# EAGLE design hotswap (EAGLE 6.1)
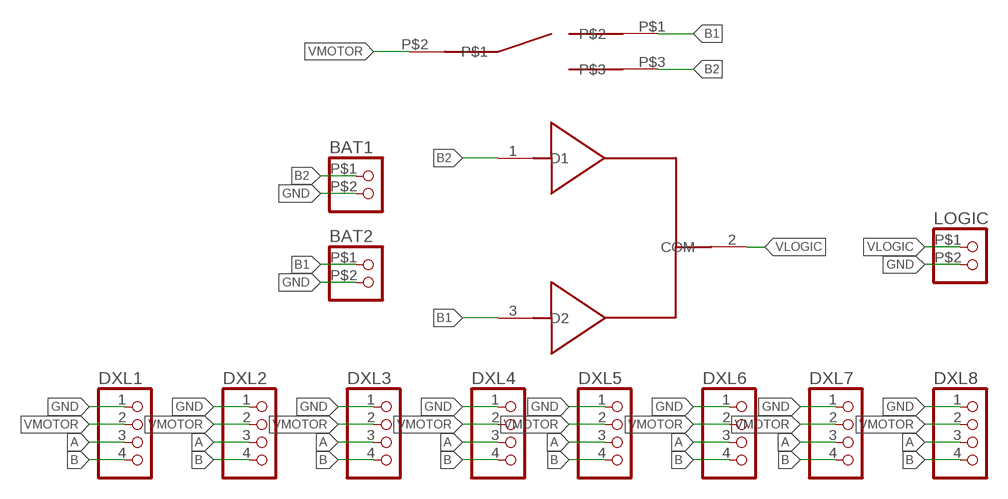
[diagram p0: schematic, sheet 1]

## Parts
BAT1  CONNEC_1X02BIG  [CONNEC_1X02_BIG]
BAT2  CONNEC_1X02BIG  [CONNEC_1X02_BIG]
DXL1  CONNEC_1X04  [CONNEC_1X04]
DXL2  CONNEC_1X04  [CONNEC_1X04]
DXL3  CONNEC_1X04  [CONNEC_1X04]
DXL4  CONNEC_1X04  [CONNEC_1X04]
DXL5  CONNEC_1X04  [CONNEC_1X04]
DXL6  CONNEC_1X04  [CONNEC_1X04]
DXL7  CONNEC_1X04  [CONNEC_1X04]
DXL8  CONNEC_1X04  [CONNEC_1X04]
LOGIC  CONNEC_1X02BIG  [CONNEC_1X02_BIG]
U$1  MBR1545CTG  [TO-220-ALT]
U$2  BIG_SPDT  [BIG_SPDT]

## Nets
A: DXL1.3 DXL2.3 DXL3.3 DXL4.3 DXL5.3 DXL6.3 DXL7.3 DXL8.3
B: DXL1.4 DXL2.4 DXL3.4 DXL4.4 DXL5.4 DXL6.4 DXL7.4 DXL8.4
B1 [alime]: BAT2.P$1 U$1.3(D2) U$2.P$1
B2 [alime]: BAT1.P$1 U$1.1(D1) U$2.P$3
GND: BAT1.P$2 BAT2.P$2 DXL1.1 DXL2.1 DXL3.1 DXL4.1 DXL5.1 DXL6.1 DXL7.1 DXL8.1 LOGIC.P$2
VLOGIC [alime]: LOGIC.P$1 U$1.2(COM)
VMOTOR: DXL1.2 DXL2.2 DXL3.2 DXL4.2 DXL5.2 DXL6.2 DXL7.2 DXL8.2 U$2.P$2

## Library data of the parts
BAT1 BAT2 LOGIC = rhoban:CONNEC_1X02
DXL1-DXL8 = rhoban:CONNEC_1X04; FARNELL: 9979620 OR 1104204
U$1 = rhoban:MBR1545CTG; FARNELL: 1431049
U$2 = rhoban:BIG_SPDT; FARNELL: 150551

## Net classes
1 alime: width 0.889 mm, drill 0.762 mm, clearance 0.508 mm

## Board
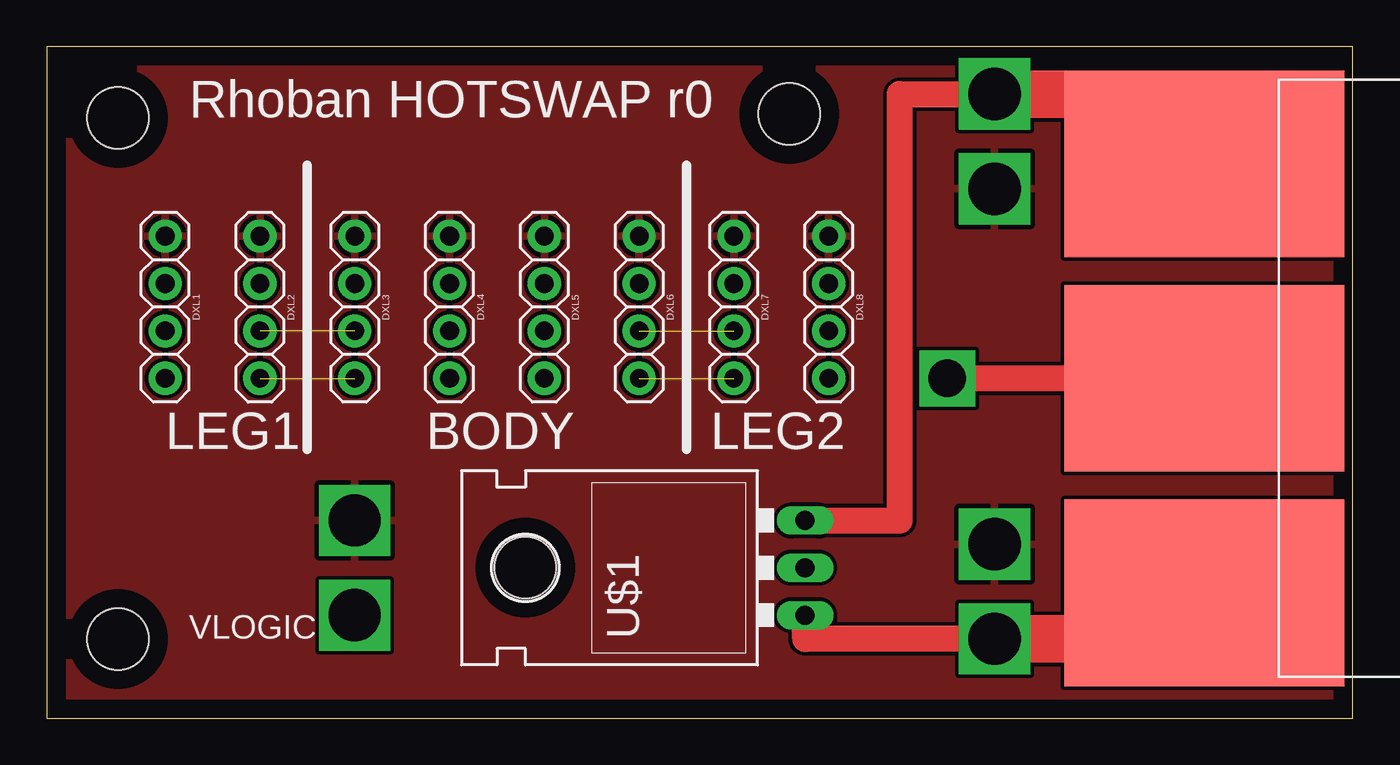
[diagram p1: board, top side]
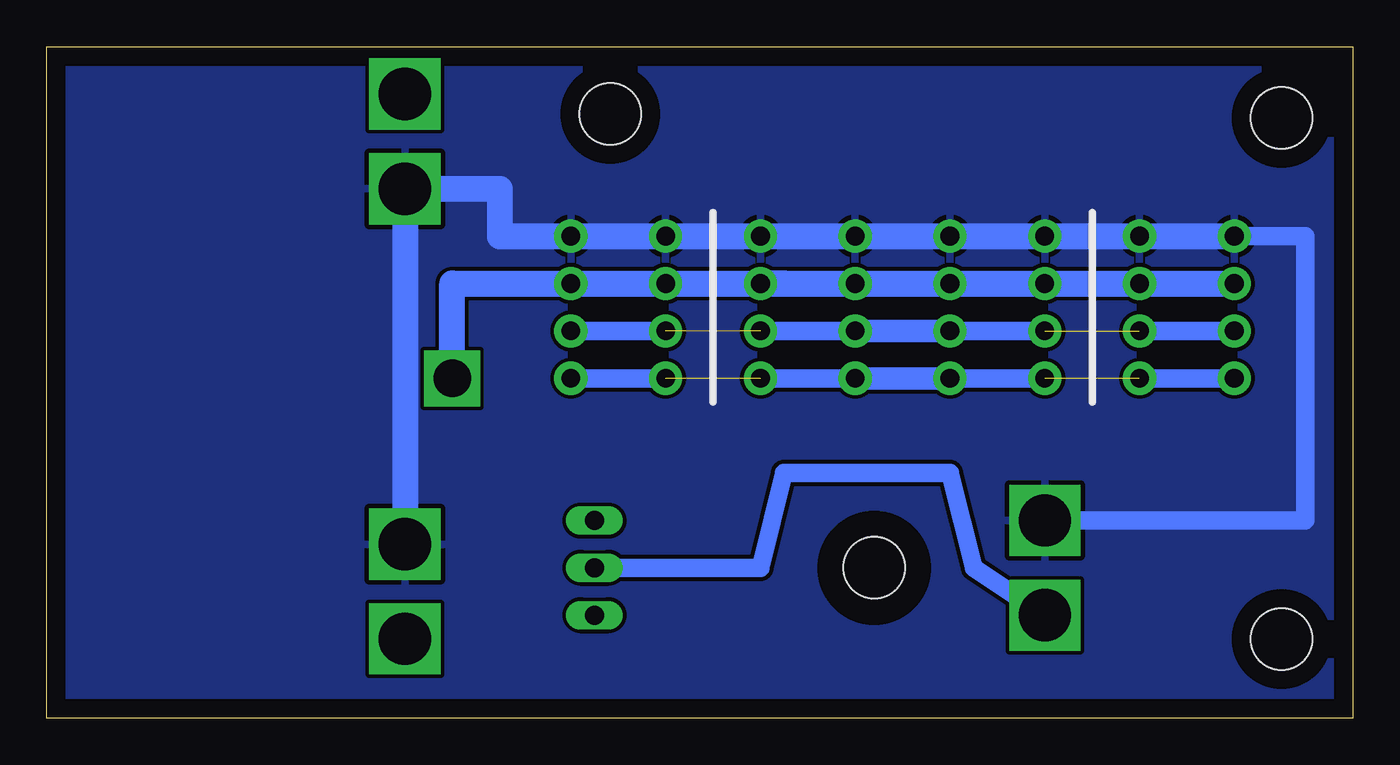
[diagram p2: board, bottom side, seen from below]

Size 70 x 36 mm. Coordinates in mm from the lower left corner, seen from the top.
Outline: 0,0 70,0 70,36 0,36 0,0
Copper layers (1*16): Top 0.035mm / dielectric 1.5mm / Bottom 0.035mm
Design rules: minimum track width 10mil, minimum drill 24mil, track to track 8mil, track to pad 8mil, pad to pad 8mil, via to via 8mil, smd to smd 8mil, copper to edge 40mil, drill to drill 8mil, minimum pad ring 10mil, minimum via ring 8mil, stop-mask expansion 4mil, vias tented up to drill 0mil, thermal gap 10mil

### Footprints (pad centres in the part's own frame; a part is rotated, then mirrored left to right if it is on the bottom)
CONNEC_1X02_BIG = drill 2.8 square: P$1 0,0; P$2 5.08,0
CONNEC_1X04 = drill 1 pad 1.778: 1 -1.27,1.27; 2 1.27,1.27; 3 3.81,1.27; 4 6.35,1.27
TO-220-ALT = drill 1.016 long: 1 -2.54,-3.81; 2 0,-3.81; 3 2.54,-3.81 | hole 3.302: 0,11.176
BIG_SPDT = smd 15 x 10: P$1 -4,11.5; P$2 -4,0; P$3 -4,-11.5
STAND-OFF = hole 3.302: 0,0

### Placement (x,y rotation side)
BAT1  50.8,4.25 90 top
BAT2  50.8,33.46 270 top
DXL1  5.08,24.57 270 top
DXL2  10.16,24.57 270 top
DXL3  15.24,24.57 270 top
DXL4  20.32,24.57 270 top
DXL5  25.4,24.57 270 top
DXL6  30.48,24.57 270 top
DXL7  35.56,24.57 270 top
DXL8  40.64,24.57 270 top
LOGIC  16.51,5.52 90 top
U$1  36.83,8.06 90 top
U$2  66.04,18.22 0 top
U$3  [STAND-OFF]  39.8,32.39 0 top
U$4  [STAND-OFF]  3.81,4.25 0 top
U$5  [STAND-OFF]  3.81,32.19 0 top

### Tracks (layer width: path | path; a pad name or v marks a point on that pad's centre or on a via)
A  (2 unrouted)
  Bottom 1: DXL8.3 DXL7.3 | DXL5.3 DXL6.3 | DXL4.3 DXL3.3 | DXL2.3 DXL1.3
  Bottom 1.2: DXL4.3 DXL5.3
B  (2 unrouted)
  Bottom 1: DXL7.4 DXL8.4 | DXL6.4 DXL5.4 | DXL1.4 DXL2.4 | DXL4.4 DXL3.4
  Bottom 1.2: DXL5.4 DXL4.4
B1
  Top 1.4: U$1.3 45.72,10.6 45.72,33.46 BAT2.P$1
  Top 2.54: BAT2.P$1 62.04,33.46 U$2.P$1
B2
  Top 1.4: BAT1.P$1 40.64,4.25 U$1.1
  Top 2.54: BAT1.P$1 62.04,4.25 U$2.P$3
GND
  Bottom 1: LOGIC.P$2 2.54,10.6 2.54,25.84 DXL1.1
  Bottom 1.4: BAT1.P$2 BAT2.P$2 45.72,28.38 45.72,25.84 DXL8.1 DXL7.1 DXL6.1 DXL5.1 DXL4.1 DXL3.1 DXL2.1 DXL1.1
  pour Bottom: -3.7,49.5 99.9,49.5 99.9,-19 -15.1,-19 -15.1,13.9
  pour Top: -8,47 96.9,47 96.9,-12.9 -20.7,-12.9 -20.7,17.3
VLOGIC
  Bottom 1: U$1.2 31.75,8.06 30.48,13.14 21.59,13.14 20.32,8.06 LOGIC.P$1
VMOTOR  (via drill 2)
  Top 1.4: U$2.P$2 v48.26,18.22
  Bottom 1.4: v48.26,18.22 48.26,23.3 DXL8.2 DXL7.2 DXL6.2 | 30.48,23.3 DXL6.2 | DXL6.2 DXL5.2 DXL4.2 DXL3.2 DXL2.2 DXL1.2

### Text on the board
tPlace: Rhoban HOTSWAP r0 | LEG1 | BODY | LEG2 | VLOGIC
tStop: B1 | GND | GND | GND | GND | GND | GND | B2